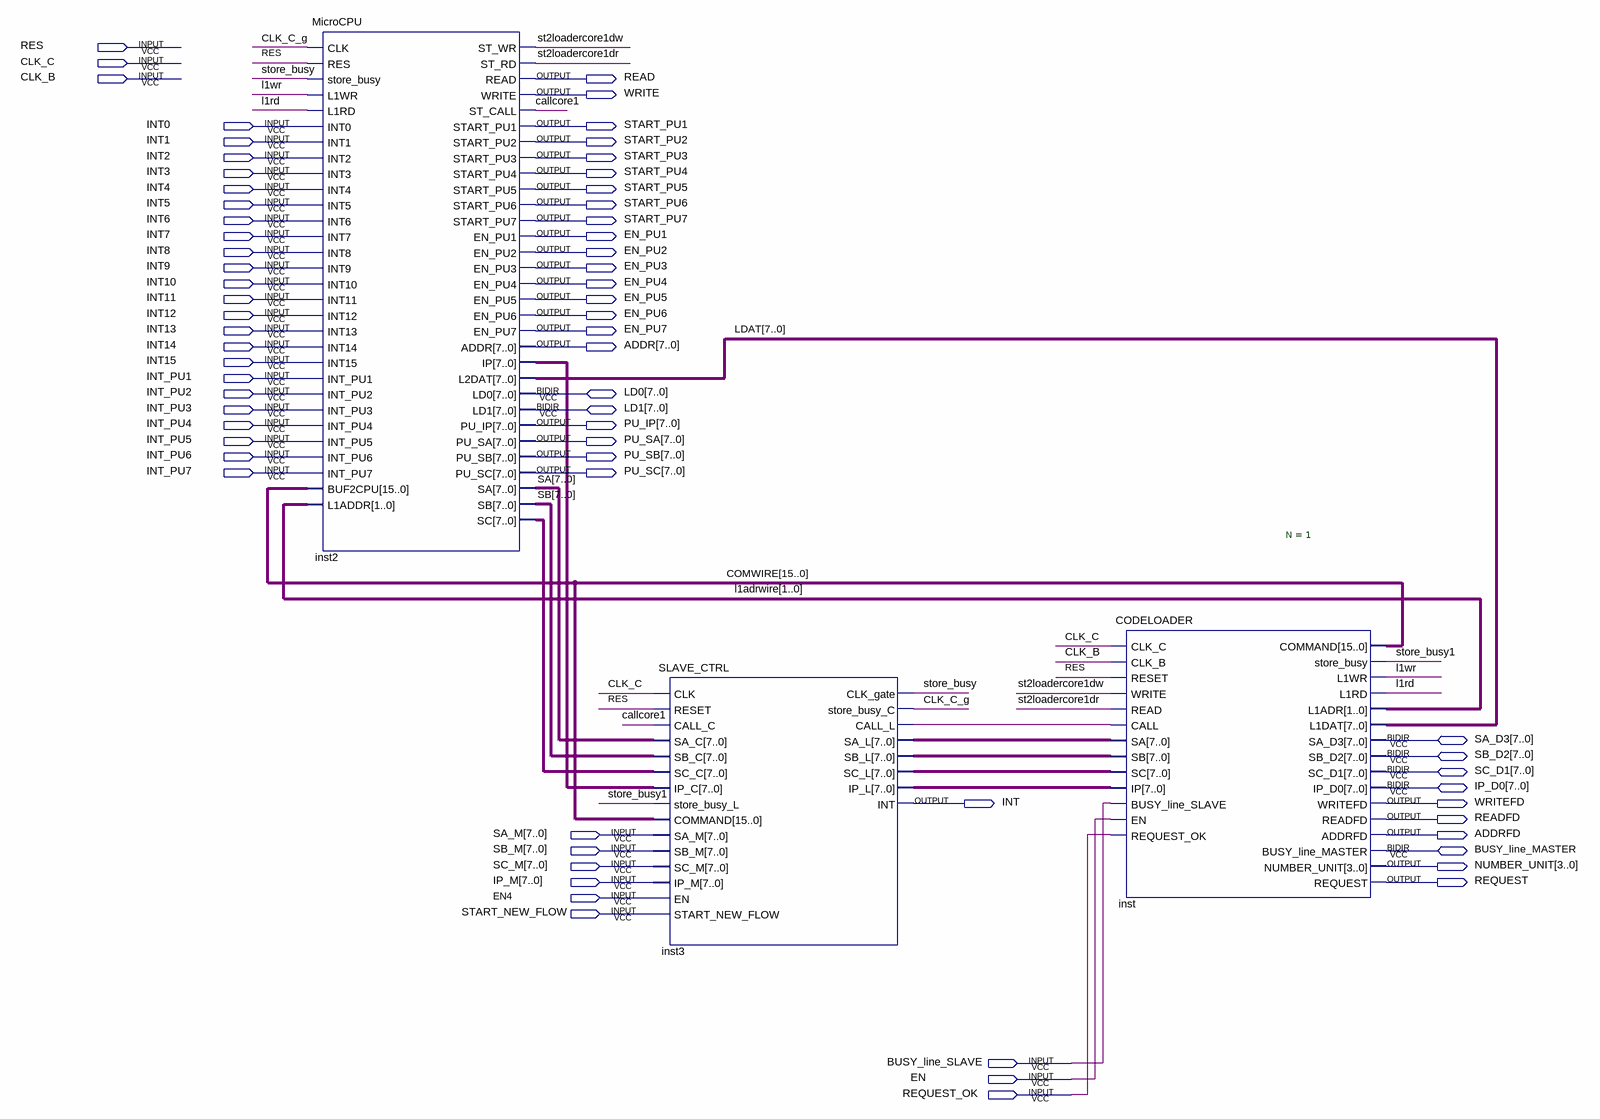
[diagram p0: schematic sheet]
// Quartus schematic CPU.bdf as structural Verilog: 3 symbols, 69 pins
module CPU (
  input  RES,
  input  CLK_C,
  input  CLK_B,
  input  INT0,
  input  INT1,
  input  INT2,
  input  INT3,
  input  INT4,
  input  INT5,
  input  INT6,
  input  INT7,
  input  INT8,
  input  INT9,
  input  INT10,
  input  INT11,
  input  INT12,
  input  INT13,
  input  INT14,
  input  INT15,
  input  INT_PU1,
  input  INT_PU2,
  input  INT_PU3,
  input  INT_PU4,
  input  INT_PU5,
  input  INT_PU6,
  input  INT_PU7,
  input  [7:0] SA_M,
  input  [7:0] SB_M,
  input  [7:0] SC_M,
  input  [7:0] IP_M,
  input  EN4,
  input  START_NEW_FLOW,
  input  BUSY_line_SLAVE,
  input  EN,
  input  REQUEST_OK,
  inout  [7:0] LD0,
  inout  [7:0] LD1,
  inout  [7:0] SA_D3,
  inout  [7:0] SB_D2,
  inout  [7:0] SC_D1,
  inout  [7:0] IP_D0,
  inout  BUSY_line_MASTER,
  output READ,
  output WRITE,
  output START_PU1,
  output START_PU2,
  output START_PU3,
  output START_PU4,
  output START_PU5,
  output START_PU6,
  output START_PU7,
  output EN_PU1,
  output EN_PU2,
  output EN_PU3,
  output EN_PU4,
  output EN_PU5,
  output EN_PU6,
  output EN_PU7,
  output [7:0] ADDR,
  output [7:0] PU_IP,
  output [7:0] PU_SA,
  output [7:0] PU_SB,
  output [7:0] PU_SC,
  output INT,
  output WRITEFD,
  output READFD,
  output ADDRFD,
  output [3:0] NUMBER_UNIT,
  output REQUEST
);

  wire callcore1, CLK_C_g, inst3_call_l, l1rd, l1wr, st2loadercore1dr, st2loadercore1dw, store_busy,
       store_busy1;
  wire [1:0] l1adrwire;
  wire [7:0] inst2_ip, inst2_sc, inst3_ip_l, inst3_sa_l, inst3_sb_l, inst3_sc_l, LDAT, SA, SB;
  wire [15:0] COMWIRE;

  MicroCPU inst2 (
    .CLK(CLK_C_g), .RES(RES), .store_busy(store_busy), .L1WR(l1wr), .L1RD(l1rd), .INT0(INT0), .INT1(INT1),
    .INT2(INT2), .INT3(INT3), .INT4(INT4), .INT5(INT5), .INT6(INT6), .INT7(INT7), .INT8(INT8), .INT9(INT9),
    .INT10(INT10), .INT11(INT11), .INT12(INT12), .INT13(INT13), .INT14(INT14), .INT15(INT15),
    .INT_PU1(INT_PU1), .INT_PU2(INT_PU2), .INT_PU3(INT_PU3), .INT_PU4(INT_PU4), .INT_PU5(INT_PU5),
    .INT_PU6(INT_PU6), .INT_PU7(INT_PU7), .BUF2CPU(COMWIRE), .L1ADDR(l1adrwire), .ST_WR(st2loadercore1dw),
    .ST_RD(st2loadercore1dr), .READ(READ), .WRITE(WRITE), .ST_CALL(callcore1), .START_PU1(START_PU1),
    .START_PU2(START_PU2), .START_PU3(START_PU3), .START_PU4(START_PU4), .START_PU5(START_PU5),
    .START_PU6(START_PU6), .START_PU7(START_PU7), .EN_PU1(EN_PU1), .EN_PU2(EN_PU2), .EN_PU3(EN_PU3),
    .EN_PU4(EN_PU4), .EN_PU5(EN_PU5), .EN_PU6(EN_PU6), .EN_PU7(EN_PU7), .ADDR(ADDR), .IP(inst2_ip),
    .PU_IP(PU_IP), .PU_SA(PU_SA), .PU_SB(PU_SB), .PU_SC(PU_SC), .SA(SA), .SB(SB), .SC(inst2_sc),
    .L2DAT(LDAT), .LD0(LD0), .LD1(LD1));
  SLAVE_CTRL inst3 (
    .CLK(CLK_C), .RESET(RES), .CALL_C(callcore1), .SA_C(SA), .SB_C(SB), .SC_C(inst2_sc), .IP_C(inst2_ip),
    .store_busy_L(store_busy1), .COMMAND(COMWIRE), .SA_M(SA_M), .SB_M(SB_M), .SC_M(SC_M), .IP_M(IP_M),
    .EN(EN4), .START_NEW_FLOW(START_NEW_FLOW), .CLK_gate(store_busy), .store_busy_C(CLK_C_g),
    .CALL_L(inst3_call_l), .SA_L(inst3_sa_l), .SB_L(inst3_sb_l), .SC_L(inst3_sc_l), .IP_L(inst3_ip_l),
    .INT(INT));
  CODELOADER #(.N(1)) inst (
    .CLK_C(CLK_C), .CLK_B(CLK_B), .RESET(RES), .WRITE(st2loadercore1dw), .READ(st2loadercore1dr),
    .CALL(inst3_call_l), .SA(inst3_sa_l), .SB(inst3_sb_l), .SC(inst3_sc_l), .IP(inst3_ip_l),
    .BUSY_line_SLAVE(BUSY_line_SLAVE), .EN(EN), .REQUEST_OK(REQUEST_OK), .COMMAND(COMWIRE),
    .store_busy(store_busy1), .L1WR(l1wr), .L1RD(l1rd), .L1ADR(l1adrwire), .WRITEFD(WRITEFD),
    .READFD(READFD), .ADDRFD(ADDRFD), .NUMBER_UNIT(NUMBER_UNIT), .REQUEST(REQUEST), .L1DAT(LDAT),
    .SA_D3(SA_D3), .SB_D2(SB_D2), .SC_D1(SC_D1), .IP_D0(IP_D0), .BUSY_line_MASTER(BUSY_line_MASTER));
endmodule
